# Altium schematic sheet Sheet3.SchDoc: Extension PSoC
size A4; DrawnBy: M. Osée; Revision: A; SheetNumber: 1; SheetTotal: 2
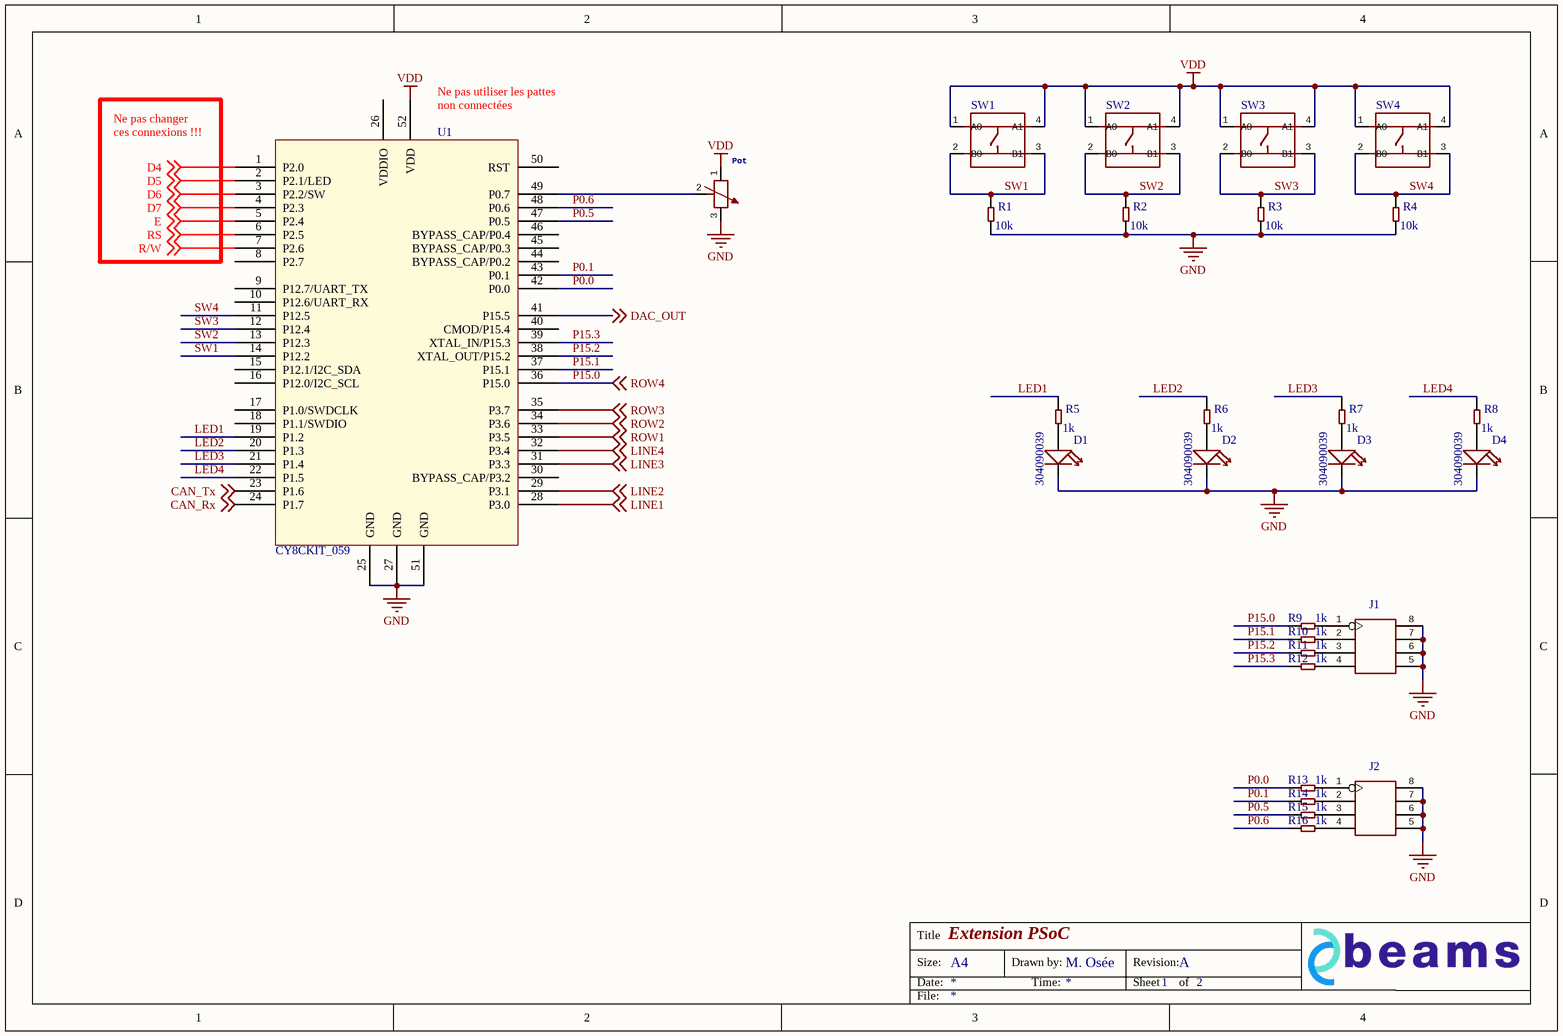
[diagram p0: Sheet3.SchDoc]

## Parts
D1  304090039  [LED-0805]
D2  304090039  [LED-0805]
D3  304090039  [LED-0805]
D4  304090039  [LED-0805]
J1  320030087  [H2X4-2.54]  (value not drawn)
J2  320030087  [H2X4-2.54]  (value not drawn)
Pot  301040022  [ADJR2+3P-11.0X9.8X12.0MM]  (value not drawn)
R1  value 10k  [R0805]  (hidden comment: 301010361)
R2  value 10k  [R0805]  (hidden comment: 301010361)
R3  value 10k  [R0805]  (hidden comment: 301010361)
R4  value 10k  [R0805]  (hidden comment: 301010361)
R5  value 1k  [R0805]  (hidden comment: 301010311)
R6  value 1k  [R0805]  (hidden comment: 301010311)
R7  value 1k  [R0805]  (hidden comment: 301010311)
R8  value 1k  [R0805]  (hidden comment: 301010311)
R9  value 1k  [R0805]  (hidden comment: 301010311)
R10  value 1k  [R0805]  (hidden comment: 301010311)
R11  value 1k  [R0805]  (hidden comment: 301010311)
R12  value 1k  [R0805]  (hidden comment: 301010311)
R13  value 1k  [R0805]  (hidden comment: 301010311)
R14  value 1k  [R0805]  (hidden comment: 301010311)
R15  value 1k  [R0805]  (hidden comment: 301010311)
R16  value 1k  [R0805]  (hidden comment: 301010311)
SW1  311020024  [SW4-6.0X6.0X5.0MM]  (value not drawn)
SW2  311020024  [SW4-6.0X6.0X5.0MM]  (value not drawn)
SW3  311020024  [SW4-6.0X6.0X5.0MM]  (value not drawn)
SW4  311020024  [SW4-6.0X6.0X5.0MM]  (value not drawn)
U1  CY8CKIT_059  [BOIT 52P_CYPRESS PSOC5]

## Nets
GND: D1.- D2.- D3.- D4.- J1.5 J1.6 J1.7 J1.8 J2.5 J2.6 J2.7 J2.8 Pot.3 Pot.P1 Pot.P2 R1.1 R2.1 R3.1 R4.1 U1.25(GND) U1.27(GND) U1.51(GND)
VDD: Pot.1 SW1.1(A0) SW1.4(A1) SW2.1(A0) SW2.4(A1) SW3.1(A0) SW3.4(A1) SW4.1(A0) SW4.4(A1) U1.52(VDD)
CAN_Rx: U1.24(P1.7) ; off-sheet CAN_Rx
CAN_Tx: U1.23(P1.6) ; off-sheet CAN_Tx
D4: U1.1(P2.0) ; off-sheet D4
D5: U1.2(P2.1/LED) ; off-sheet D5
D6: U1.3(P2.2/SW) ; off-sheet D6
D7: U1.4(P2.3) ; off-sheet D7
DAC_OUT: U1.41(P15.5) ; off-sheet DAC_OUT
E: U1.5(P2.4) ; off-sheet E
LED1: R5.2 U1.19(P1.2)
LED2: R6.2 U1.20(P1.3)
LED3: R7.2 U1.21(P1.4)
LED4: R8.2 U1.22(P1.5)
LINE1: U1.28(P3.0) ; off-sheet LINE1
LINE2: U1.29(P3.1) ; off-sheet LINE2
LINE3: U1.31(P3.3) ; off-sheet LINE3
LINE4: U1.32(P3.4) ; off-sheet LINE4
P0.0: R13.2 U1.42(P0.0)
P0.1: R14.2 U1.43(P0.1)
P0.5: R15.2 U1.47(P0.5)
P0.6: R16.2 U1.48(P0.6)
P15.0: R9.2 U1.36(P15.0) ; off-sheet ROW4  [also labelled ROW4]
P15.1: R10.2 U1.37(P15.1)
P15.2: R11.2 U1.38(XTAL_OUT/P15.2)
P15.3: R12.2 U1.39(XTAL_IN/P15.3)
R/W: U1.7(P2.6) ; off-sheet R/W
ROW1: U1.33(P3.5) ; off-sheet ROW1
ROW2: U1.34(P3.6) ; off-sheet ROW2
ROW3: U1.35(P3.7) ; off-sheet ROW3
RS: U1.6(P2.5) ; off-sheet RS
SW1: R1.2 SW1.2(B0) SW1.3(B1) U1.14(P12.2)
SW2: R2.2 SW2.2(B0) SW2.3(B1) U1.13(P12.3)
SW3: R3.2 SW3.2(B0) SW3.3(B1) U1.12(P12.4)
SW4: R4.2 SW4.2(B0) SW4.3(B1) U1.11(P12.5)
NetD1_+: D1.+ R5.1
NetD2_+: D2.+ R6.1
NetD3_+: D3.+ R7.1
NetD4_+: D4.+ R8.1
NetJ1_1: J1.1 R9.1
NetJ1_2: J1.2 R10.1
NetJ1_3: J1.3 R11.1
NetJ1_4: J1.4 R12.1
NetJ2_1: J2.1 R13.1
NetJ2_2: J2.2 R14.1
NetJ2_3: J2.3 R15.1
NetJ2_4: J2.4 R16.1
NetPot_2: Pot.2 U1.49(P0.7)

Not connected (* = marked no-connect by the designer): U1 8(P2.7) 9(P12.7/UART_TX) 10(P12.6/UART_RX) 15(P12.1/I2C_SDA) 16(P12.0/I2C_SCL) 17(P1.0/SWDCLK) 18(P1.1/SWDIO) 26(VDDIO) 30(BYPASS_CAP/P3.2) 40(CMOD/P15.4) 44(BYPASS_CAP/P0.2) 45(BYPASS_CAP/P0.3) 46(BYPASS_CAP/P0.4) 50(RST)

## Notes on the sheet
- (near U1) Ne pas utiliser les pattes
- (near U1) non connectées
- Ne pas changer
- (near U1) ces connexions !!!
- Title
- Size:
- Date:
- A4
- Drawn by:
- Time:
- Revision:
- Sheet
- of
- File:

## Library data of the parts
D1-D4 = SMD-LED-CLEAR-YELLOW(0805): MPN: 17-215UYC/S530-A3/TR8
J1 J2 = DIP-BLACK-FEMALE-HEADER(2X4P-2.54)
Pot = DIP-VR-TOP-ADJ-10K(3+2P-11.0X9.8X12.0MM): MPN: WH09-2-103
R1-R4 = SMD-RES-10K-1%-1/8W(0805): MPN: RC0805FR-0710KL
R5-R16 = SMD-RES-1K-5%-1/8W(0805): MPN: RC0805JR-071KL
SW1-SW4 = DIP-SWITCH-TACTILE-SPST-NO/TS-1109(4P-D6.0MM)'TS-1109'
U1 = CI CY8CKIT_059: Published: 24-Mar-1999; LatestRevisionDate: 29-May-2009; Publisher: Altium Limited